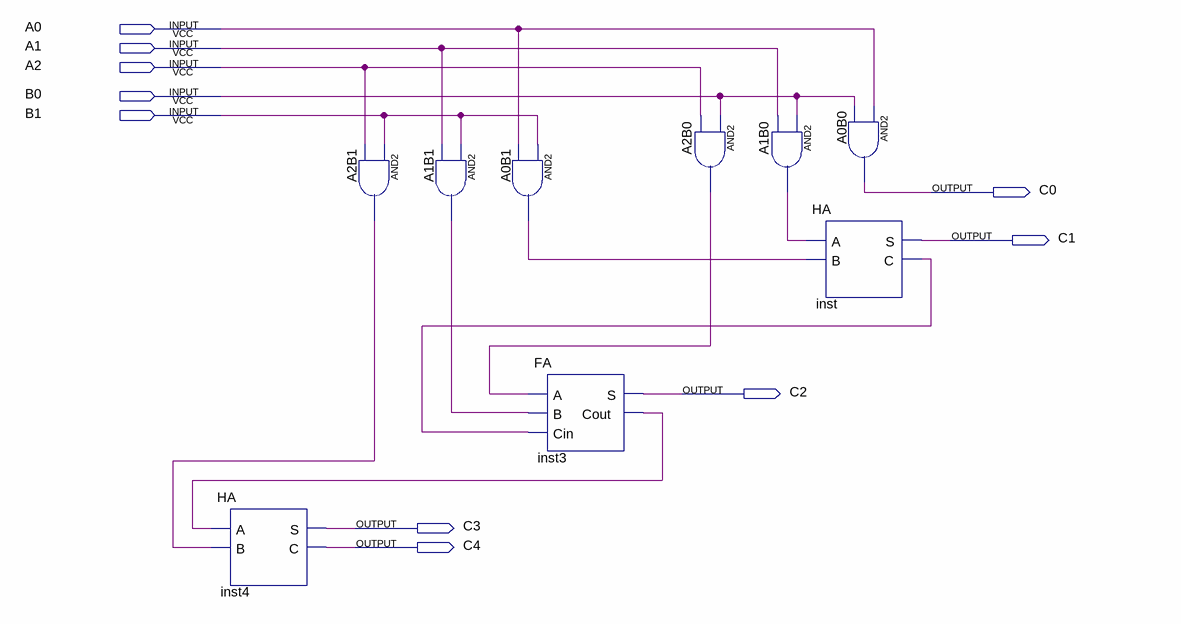
[diagram p0: schematic sheet]
// Quartus schematic Question1.bdf as structural Verilog: 9 symbols, 10 pins
module Question1 (
  input  A0,
  input  A1,
  input  A2,
  input  B0,
  input  B1,
  output C0,
  output C1,
  output C2,
  output C3,
  output C4
);

  wire A0B1_out, A1B0_out, A1B1_out, A2B0_out, A2B1_out, inst3_cout, inst_c;

  HA inst4 (.A(inst3_cout), .B(A2B1_out), .S(C3), .C(C4));
  and A2B1 (A2B1_out, B1, A2);
  and A1B1 (A1B1_out, B1, A1);
  and A0B1 (A0B1_out, B1, A0);
  FA inst3 (.A(A2B0_out), .B(A1B1_out), .Cin(inst_c), .S(C2), .Cout(inst3_cout));
  and A2B0 (A2B0_out, B0, A2);
  and A1B0 (A1B0_out, B0, A1);
  HA inst (.A(A1B0_out), .B(A0B1_out), .S(C1), .C(inst_c));
  and A0B0 (C0, A0, B0);
endmodule
